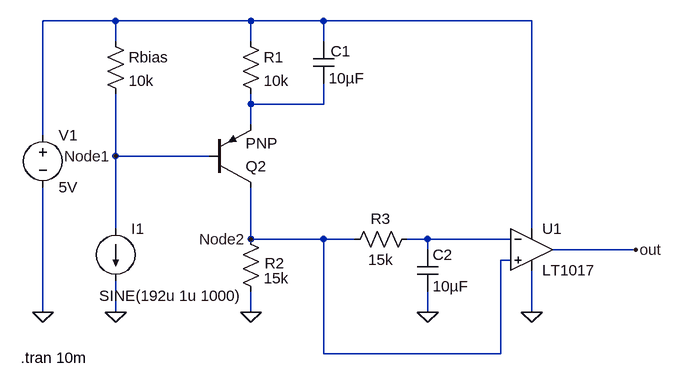
[diagram p0: schematic Transistor Amplifier Comparator.asc]
Transistor Amplifier Comparator.asc, the LTspice schematic file:
Version 4
SHEET 1 880 680
WIRE -112 -144 -224 -144
WIRE 96 -144 -112 -144
WIRE 208 -144 96 -144
WIRE 528 -144 208 -144
WIRE -112 -112 -112 -144
WIRE 96 -112 96 -144
WIRE 208 -112 208 -144
WIRE 96 -16 96 -32
WIRE 208 -16 208 -48
WIRE 208 -16 96 -16
WIRE 96 16 96 -16
WIRE -224 32 -224 -144
WIRE -112 64 -112 -32
WIRE 32 64 -112 64
WIRE -112 176 -112 64
WIRE 528 176 528 -144
WIRE 96 192 96 112
WIRE 208 192 96 192
WIRE 256 192 208 192
WIRE 368 192 336 192
WIRE 496 192 368 192
WIRE 368 208 368 192
WIRE 688 208 560 208
WIRE 496 224 480 224
WIRE -224 304 -224 112
WIRE -112 304 -112 256
WIRE 96 304 96 272
WIRE 368 304 368 272
WIRE 528 304 528 240
WIRE 208 368 208 192
WIRE 480 368 480 224
WIRE 480 368 208 368
FLAG 368 304 0
FLAG 96 304 0
FLAG 528 304 0
FLAG -112 304 0
FLAG -224 304 0
FLAG 688 208 out
FLAG -112 64 Node1
FLAG 96 192 Node2
SYMBOL res 80 -128 R0
SYMATTR InstName R1
SYMATTR Value 10k
SYMBOL res 80 176 R0
WINDOW 0 37 53 Left 2
SYMATTR InstName R2
SYMATTR Value 15k
SYMBOL res 352 176 R90
WINDOW 0 0 56 VBottom 2
WINDOW 3 32 56 VTop 2
SYMATTR InstName R3
SYMATTR Value 15k
SYMBOL res -128 -128 R0
SYMATTR InstName Rbias
SYMATTR Value 10k
SYMBOL cap 192 -112 R0
WINDOW 0 27 15 Left 2
SYMATTR InstName C1
SYMATTR Value 10µF
SYMBOL cap 352 208 R0
SYMATTR InstName C2
SYMATTR Value 10µF
SYMBOL Comparators\\LT1017 528 208 R0
SYMATTR InstName U1
SYMBOL pnp2 32 112 M180
SYMATTR InstName Q2
SYMBOL current -112 176 R0
WINDOW 3 -25 103 Left 2
WINDOW 123 0 0 Left 0
WINDOW 39 0 0 Left 0
SYMATTR InstName I1
SYMATTR Value SINE(192u 1u 1000)
SYMBOL voltage -224 16 R0
WINDOW 123 0 0 Left 0
WINDOW 39 0 0 Left 0
SYMATTR InstName V1
SYMATTR Value 5V
TEXT -258 374 Left 2 !.tran 10m

The netlist it stands for:
* Transistor Amplifier Comparator.asc
R1 N001 N002 10k
R2 Node2 0 15k
R3 N003 Node2 15k
Rbias N001 Node1 10k
C1 N001 N002 10µF
C2 N003 0 10µF
XU1 Node2 N003 N001 0 out LT1017  ; pins In+ In- V+ V- OUT
Q2 Node2 Node1 N002 0 PNP
I1 Node1 0 SINE(192u 1u 1000)
V1 N001 0 5V
.model NPN NPN
.model PNP PNP
.lib standard.bjt
.tran 10m
.backanno
.end